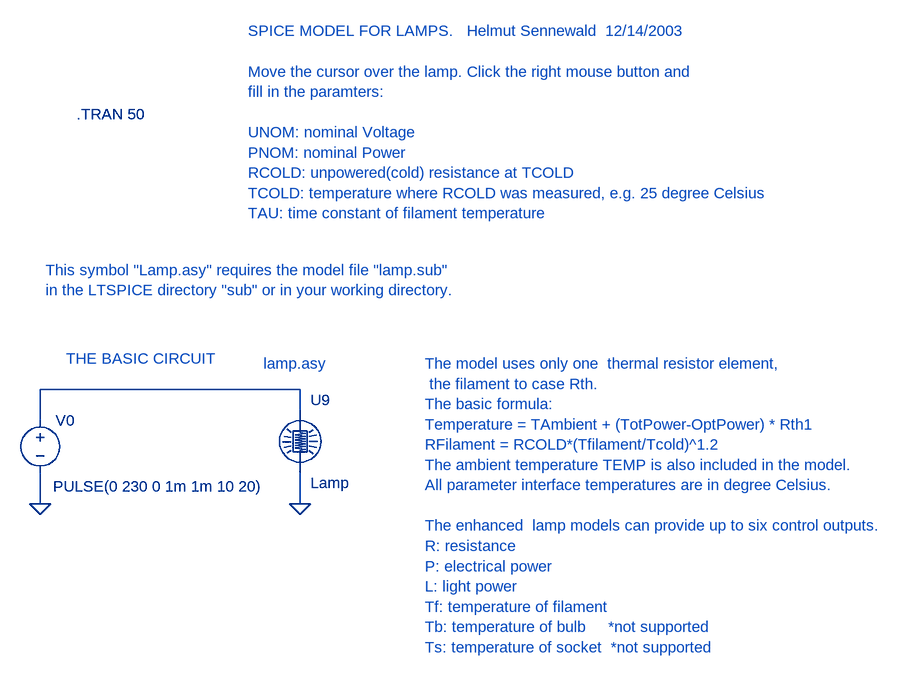
[diagram p0: schematic easy_lamp_test.asc]
easy_lamp_test.asc, the LTspice schematic file:
Version 4
SHEET 1 1912 680
WIRE -160 -624 -160 -576
WIRE 240 -720 240 -752
WIRE 240 -624 240 -576
WIRE 240 -752 -160 -752
WIRE -160 -752 -160 -704
FLAG -160 -576 0
FLAG 240 -576 0
SYMBOL voltage -160 -720 R0
WINDOW 123 0 0 Left 0
WINDOW 39 0 0 Left 0
WINDOW 3 20 117 Left 0
SYMATTR Value PULSE(0 230 0 1m 1m 10 20)
SYMATTR InstName V0
SYMBOL Misc\\lamp 240 -672 R0
SYMATTR InstName U9
TEXT -104 -1176 Left 0 !.TRAN 50
TEXT 432 -792 Left 0 ;The model uses only one  thermal resistor element, \n the filament to case Rth. \nThe basic formula:\nTemperature = TAmbient + (TotPower-OptPower) * Rth1\nRFilament = RCOLD*(Tfilament/Tcold)^1.2\nThe ambient temperature TEMP is also included in the model.\nAll parameter interface temperatures are in degree Celsius.\n \nThe enhanced  lamp models can provide up to six control outputs.\nR: resistance  \nP: electrical power \nL: light power \nTf: temperature of filament   \nTb: temperature of bulb     *not supported\nTs: temperature of socket  *not supported
TEXT 160 -1304 Left 0 ;SPICE MODEL FOR LAMPS.   Helmut Sennewald  12/14/2003\n \nMove the cursor over the lamp. Click the right mouse button and \nfill in the paramters: \n \nUNOM: nominal Voltage\nPNOM: nominal Power\nRCOLD: unpowered(cold) resistance at TCOLD\nTCOLD: temperature where RCOLD was measured, e.g. 25 degree Celsius\nTAU: time constant of filament temperature
TEXT 184 -792 Left 0 ;lamp.asy
TEXT -120 -800 Left 0 ;THE BASIC CIRCUIT
TEXT -152 -936 Left 0 ;This symbol "Lamp.asy" requires the model file "lamp.sub"\nin the LTSPICE directory "sub" or in your working directory.

The netlist it stands for:
* easy_lamp_test.asc
V0 N001 0 PULSE(0 230 0 1m 1m 10 20)
XU9 N001 0 Lamp UNOM=230V  PNOM=100W RCOLD=40  TCOLD=25  TAU=2s TAMB=25  ; pins V+ V-
.TRAN 50
* The model uses only one  thermal resistor element,
*  the filament to case Rth.
* The basic formula:
* Temperature = TAmbient + (TotPower-OptPower) * Rth1
* RFilament = RCOLD*(Tfilament/Tcold)^1.2
* The ambient temperature TEMP is also included in the model.
* All parameter interface temperatures are in degree Celsius.
* The enhanced  lamp models can provide up to six control outputs.
* R: resistance
* P: electrical power
* L: light power
* Tf: temperature of filament
* Tb: temperature of bulb     *not supported
* Ts: temperature of socket  *not supported
* SPICE MODEL FOR LAMPS.   Helmut Sennewald  12/14/2003
* Move the cursor over the lamp. Click the right mouse button and
* fill in the paramters:
* UNOM: nominal Voltage
* PNOM: nominal Power
* RCOLD: unpowered(cold) resistance at TCOLD
* TCOLD: temperature where RCOLD was measured, e.g. 25 degree Celsius
* TAU: time constant of filament temperature
* lamp.asy
* THE BASIC CIRCUIT
* This symbol "Lamp.asy" requires the model file "lamp.sub"
* in the LTSPICE directory "sub" or in your working directory.
.lib lamp.sub
.backanno
.end